# EAGLE schematic TRV_MRF49_U_V1.1_BF (EAGLE 6.3)
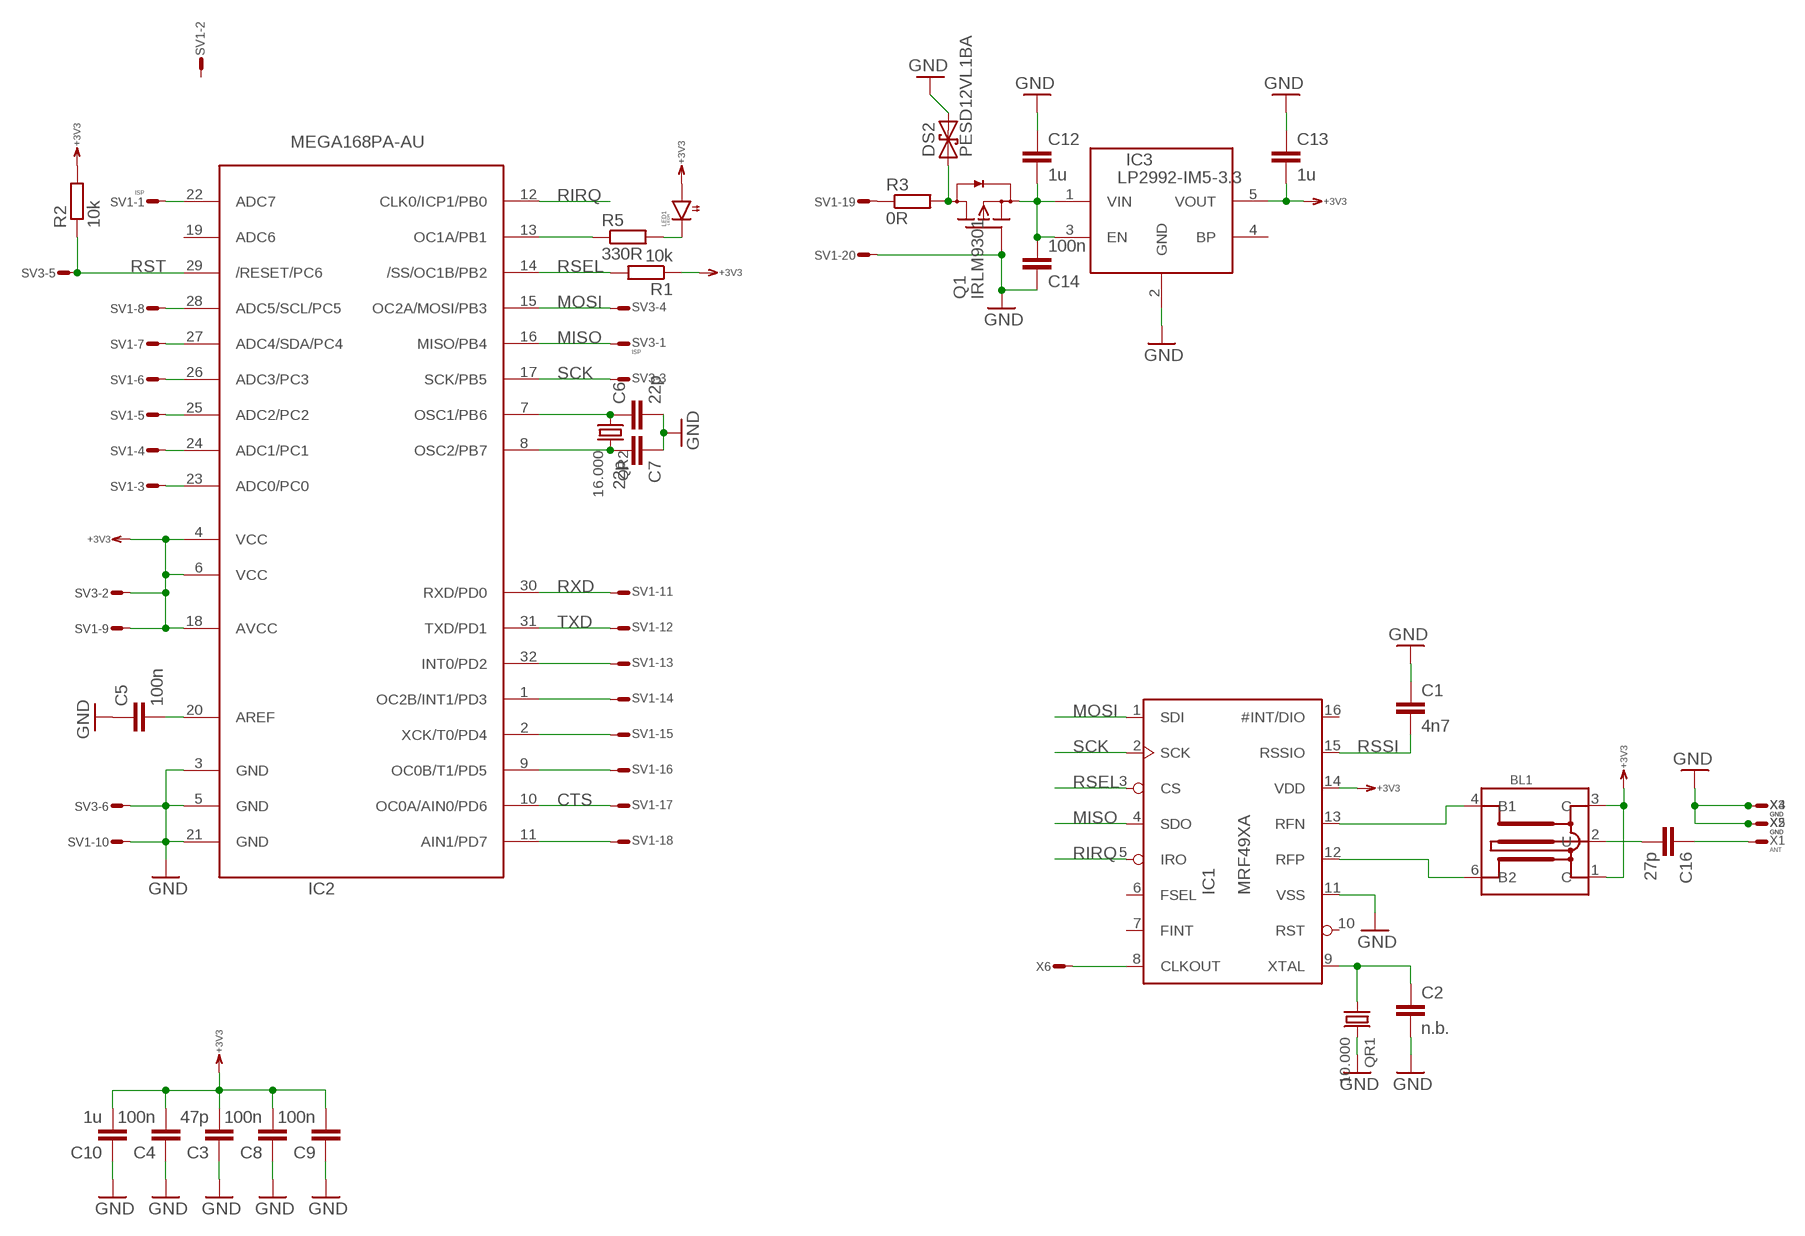
[diagram p0: schematic, sheet 1]

## Parts
BL1  BL1  [BL]
C1  4n7  C0603  [0603]
C2  n.b.  C0603  [0603]
C3  47p  C0603  [0603]
C4  100n  C0603  [0603]
C5  100n  C0603  [0603]
C6  22p  C0603  [0603]
C7  22p  C0603  [0603]
C8  100n  C0603  [0603]
C9  100n  C0603  [0603]
C10  1u  C0603  [0603]
C12  1u  C0603  [0603]
C13  1u  C0603  [0603]
C14  100n  C0603  [0603]
C16  27p  C0603  [0603]
DS2  PESD12VL1BA  TVS-U323  [SOD323]
IC1  MRF49XA  [TSSOP16]
IC2  MEGA168PA-AU  MEGA168PA  [TQFP32-08]
IC3  LP2992-IM5-3.3  LDO  [SOT23-5]
LED1  LEDR  LED0603  [0603]
Q1  IRLM9301  FET-PDSOT23  [SOT23]
QR1  10.000  Q49UV  [HC49U-V]
QR2  16.000  Q49UV  [HC49U-V]
R1  10k  R0603  [0603]
R2  10k  R0603  [0603]
R3  0R  R0603  [0603]
R5  330R  R0603  [0603]
SV1  ISP  ML20E  [ML20]
SV3  ISP  ML6E  [ML6]
X1  ANT  WIREPADS2.54/1.27  [S2.54/1.27]
X2  GND  WIREPADS2.54/1.27  [S2.54/1.27]
X3  GND  WIREPADS2.54/1.27  [S2.54/1.27]
X4  GND  WIREPADS2.54/1.27  [S2.54/1.27]
X5  GND  WIREPADS2.54/1.27  [S2.54/1.27]
X6  WIREPADR  [S1.27R]

## Nets
+3V3: BL1.1(C) BL1.3(C) C3.2 C4.2 C8.2 C9.2 C10.2 C13.2 IC1.14(VDD) IC2.4(VCC) IC2.6(VCC) IC2.18(AVCC) IC3.5(VOUT) LED1.1(A) R1.1 R2.2 SV1.9 SV3.2
CTS: IC2.10(OC0A/AIN0/PD6) SV1.17
GND: C1.1 C2.2 C3.1 C4.1 C5.1 C6.2 C7.1 C8.1 C9.1 C10.1 C12.1 C13.1 C14.1 DS2.C IC1.11(VSS) IC2.3(GND) IC2.5(GND) IC2.21(GND) IC3.2(GND) Q1.1(G) QR1.2 SV1.10 SV1.20 SV3.6 X2.1(S) X3.1(S) X4.1(S) X5.1(S)
LED: IC2.13(OC1A/PB1) R5.1
MISO: IC1.4(SDO) IC2.16(MISO/PB4) SV3.1
MOSI: IC1.1(SDI) IC2.15(OC2A/MOSI/PB3) SV3.4
N$1: IC1.8(CLKOUT) X6.1(S)
N$2: BL1.4(B1) IC1.13(RFN)
N$3: IC2.22(ADC7) SV1.1
N$4: C2.1 IC1.9(XTAL) QR1.1
N$5: DS2.A Q1.3(D) R3.2
N$6: C5.2 IC2.20(AREF)
N$7: BL1.6(B2) IC1.12(RFP)
N$8: BL1.2(U) C16.2
N$12: C12.2 C14.2 IC3.1(VIN) IC3.3(EN) Q1.2(S)
N$18: C6.1 IC2.7(OSC1/PB6) QR2.1
N$19: C7.2 IC2.8(OSC2/PB7) QR2.2
N$21: LED1.2(C) R5.2
N$23: R3.1 SV1.19
N$25: C16.1 X1.1(S)
PC0: IC2.23(ADC0/PC0) SV1.3
PC1: IC2.24(ADC1/PC1) SV1.4
PC2: IC2.25(ADC2/PC2) SV1.5
PC3: IC2.26(ADC3/PC3) SV1.6
PC4: IC2.27(ADC4/SDA/PC4) SV1.7
PC5: IC2.28(ADC5/SCL/PC5) SV1.8
PD2: IC2.32(INT0/PD2) SV1.13
PD3: IC2.1(OC2B/INT1/PD3) SV1.14
PD4: IC2.2(XCK/T0/PD4) SV1.15
PD5: IC2.9(OC0B/T1/PD5) SV1.16
PD7: IC2.11(AIN1/PD7) SV1.18
RIRQ: IC1.5(IRO) IC2.12(CLK0/ICP1/PB0)
RSEL: IC1.3(CS) IC2.14(/SS/OC1B/PB2) R1.2
RSSI: C1.2 IC1.15(RSSIO)
RST: IC2.29(/RESET/PC6) R2.1 SV3.5
RXD: IC2.30(RXD/PD0) SV1.11
SCK: IC1.2(SCK) IC2.17(SCK/PB5) SV3.3
TXD: IC2.31(TXD/PD1) SV1.12
Unconnected: IC1.6(FSEL) IC1.7(FINT) IC1.10(RST) IC1.16(#INT/DIO) IC2.19(ADC6) IC3.4(BP) SV1.2

## Library data of the parts
BL1 = RF:BL
C1-C10 C12-C14 C16 = RCL:C: Capacitor SMD
DS2 = Diode:TVS-U: DIODE
IC1 = Other:MRF49XA
IC2 = atmel:MEGA168P: MCU, 4/8/16k, TQFP32
IC3 = DCDC:LDO
LED1 = Optic:LED
Q1 = Transistor:FET-PD
QR1 QR2 = QUARTZ:Q
R1-R3 R5 = RCL:R: Resistor SMD
SV1 = Conn:ML20?E: HARTING
SV3 = Conn:ML6E: HARTING
X1-X6 = Conn:WIREPAD: Wire PAD connect wire on PCB